# Altium project Node.PrjPCB (part 2 of 3)

## Sheet Power.SchDoc
size Letter
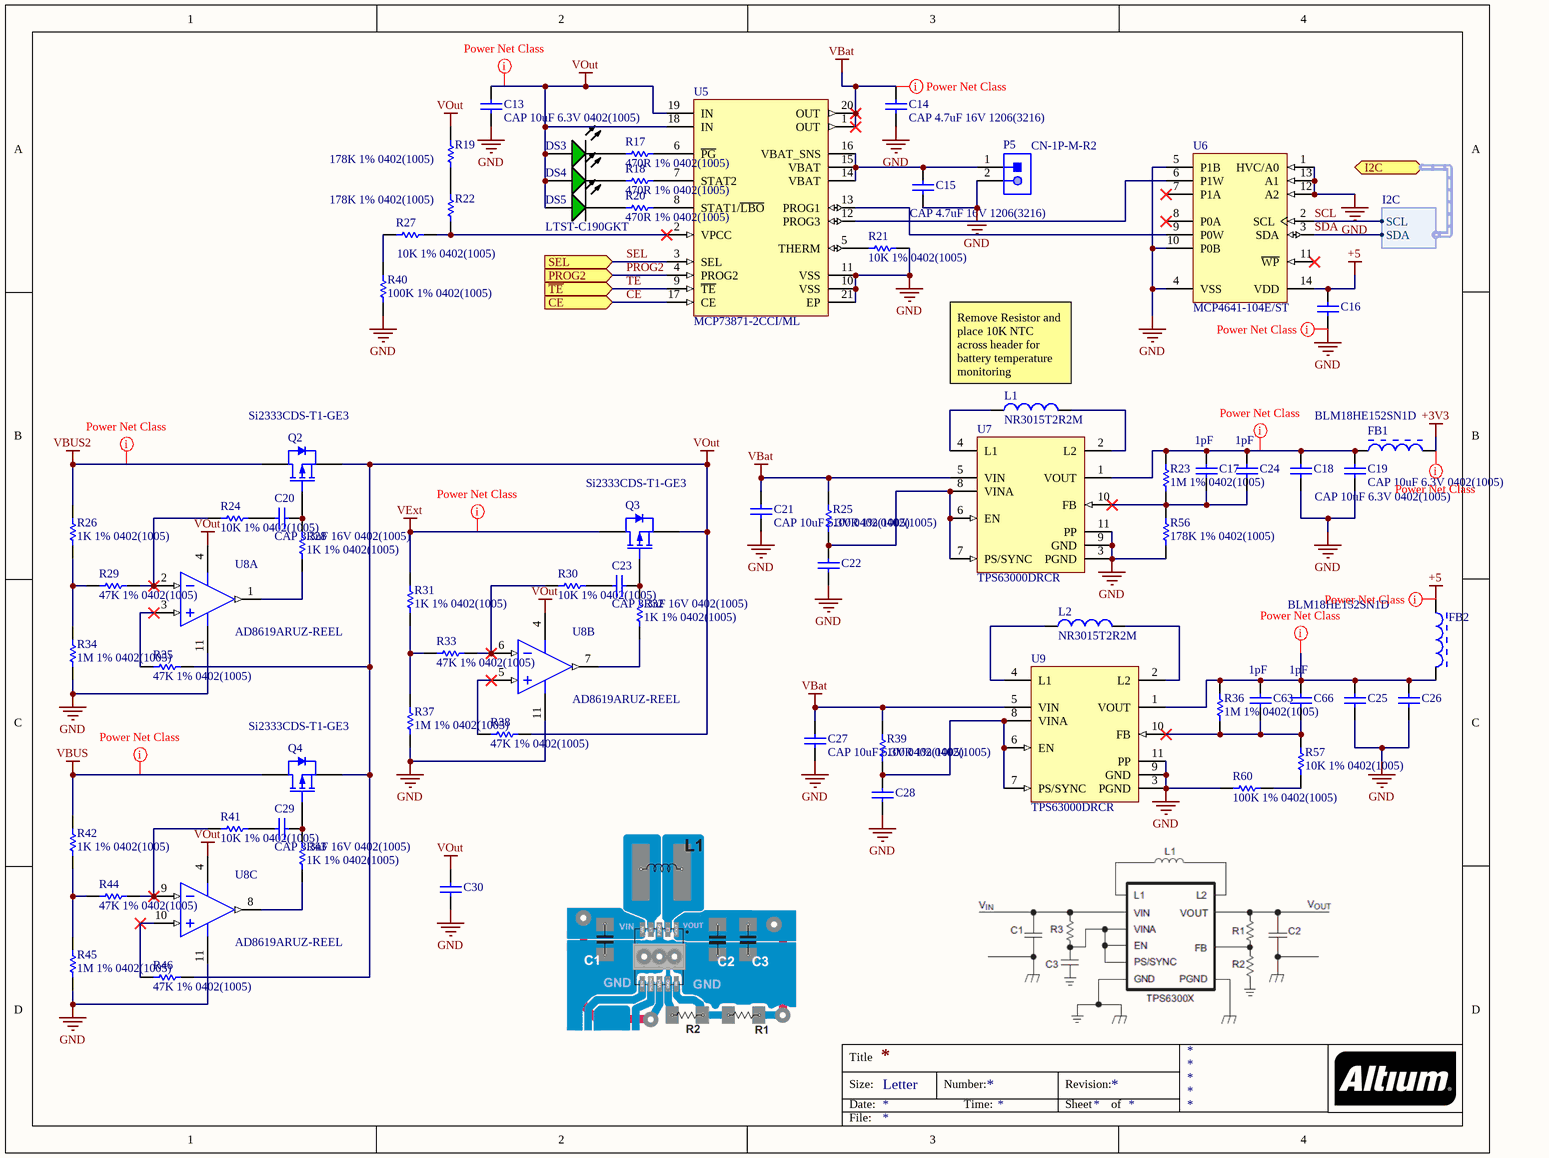
[diagram p6: Power.SchDoc]

### Parts
(Parts that share a designator on the sheet are numbered #1, #2 ... from top to bottom, then left to right.)
C13  CAP 10uF 6.3V 0402(1005)  [CAPC0402(1005)60_L]
C14  CAP 4.7uF 16V 1206(3216)  [CAPC1206(3216)190_N]
C15  CAP 4.7uF 16V 1206(3216)  [CAPC1206(3216)190_N]
C16  CAP 100nF 10V 0402(1005)  [CAPC0402(1005)60_L]  (value not drawn)
C17  value 1pF  [CAPC0402(1005)33_L]  (hidden comment: CAP 1pF 50V 0402(1005))
C18  CAP 10uF 6.3V 0402(1005)  [CAPC0402(1005)60_L]
C19  CAP 10uF 6.3V 0402(1005)  [CAPC0402(1005)60_L]
C20  CAP 3.3nF 16V 0402(1005)  [CAPC0402(1005)60_L]
C21  CAP 10uF 6.3V 0402(1005)  [CAPC0402(1005)60_L]
C22  CAP 100nF 10V 0402(1005)  [CAPC0402(1005)60_L]  (value not drawn)
C23  CAP 3.3nF 16V 0402(1005)  [CAPC0402(1005)60_L]
C24  value 1pF  [CAPC0402(1005)33_L]  (hidden comment: CAP 1pF 50V 0402(1005))
C25  CAP 10uF 6.3V 0402(1005)  [CAPC0402(1005)60_L]  (value not drawn)
C26  CAP 10uF 6.3V 0402(1005)  [CAPC0402(1005)60_L]  (value not drawn)
C27  CAP 10uF 6.3V 0402(1005)  [CAPC0402(1005)60_L]
C28  CAP 100nF 10V 0402(1005)  [CAPC0402(1005)60_L]  (value not drawn)
C29  CAP 3.3nF 16V 0402(1005)  [CAPC0402(1005)60_L]
C30  CAP 100nF 10V 0402(1005)  [CAPC0402(1005)60_L]  (value not drawn)
C63  value 1pF  [CAPC0402(1005)33_L]  (hidden comment: CAP 1pF 50V 0402(1005))
C66  value 1pF  [CAPC0402(1005)33_L]  (hidden comment: CAP 1pF 50V 0402(1005))
DS3  LTST-C190GKT  [LTST-C190GKT_V]  (value not drawn)
DS4  LTST-C190GKT  [LTST-C190GKT_V]  (value not drawn)
DS5  LTST-C190GKT  [LTST-C190GKT_V]
FB1  BLM18HE152SN1D  [MURA-BLM18-RF-H4-CHIP-2_V]
FB2  BLM18HE152SN1D  [MURA-BLM18-RF-H4-CHIP-2_V]
L1  NR3015T2R2M  [TAYO-IND0315_V]
L2  NR3015T2R2M  [TAYO-IND0315_V]
P5  CN-1P-M-R2  [B2B-PH-K-S]
Q2  Si2333CDS-T1-GE3  [DIOD-SOT23-3_V]
Q3  Si2333CDS-T1-GE3  [DIOD-SOT23-3_V]
Q4  Si2333CDS-T1-GE3  [DIOD-SOT23-3_V]
R17  470R 1% 0402(1005)  [RESC0402(1005)_L]
R18  470R 1% 0402(1005)  [RESC0402(1005)_L]
R19  178K 1% 0402(1005)  [RESC0402(1005)_L]
R20  470R 1% 0402(1005)  [RESC0402(1005)_L]
R21  10K 1% 0402(1005)  [RESC0402(1005)_L]
R22  178K 1% 0402(1005)  [RESC0402(1005)_L]
R23  1M 1% 0402(1005)  [RESC0402(1005)_L]
R24  10K 1% 0402(1005)  [RESC0402(1005)_L]
R25  100R 1% 0402(1005)  [RESC0402(1005)_L]
R26  1K 1% 0402(1005)  [RESC0402(1005)_L]
R27  10K 1% 0402(1005)  [RESC0402(1005)_L]
R28  1K 1% 0402(1005)  [RESC0402(1005)_L]
R29  47K 1% 0402(1005)  [RESC0402(1005)_L]
R30  10K 1% 0402(1005)  [RESC0402(1005)_L]
R31  1K 1% 0402(1005)  [RESC0402(1005)_L]
R32  1K 1% 0402(1005)  [RESC0402(1005)_L]
R33  47K 1% 0402(1005)  [RESC0402(1005)_L]
R34  1M 1% 0402(1005)  [RESC0402(1005)_L]
R35  47K 1% 0402(1005)  [RESC0402(1005)_L]
R36  1M 1% 0402(1005)  [RESC0402(1005)_L]
R37  1M 1% 0402(1005)  [RESC0402(1005)_L]
R38  47K 1% 0402(1005)  [RESC0402(1005)_L]
R39  100R 1% 0402(1005)  [RESC0402(1005)_L]
R40  100K 1% 0402(1005)  [RESC0402(1005)_L]
R41  10K 1% 0402(1005)  [RESC0402(1005)_L]
R42  1K 1% 0402(1005)  [RESC0402(1005)_L]
R43  1K 1% 0402(1005)  [RESC0402(1005)_L]
R44  47K 1% 0402(1005)  [RESC0402(1005)_L]
R45  1M 1% 0402(1005)  [RESC0402(1005)_L]
R46  47K 1% 0402(1005)  [RESC0402(1005)_L]
R56  178K 1% 0402(1005)  [RESC0402(1005)_L]
R57  10K 1% 0402(1005)  [RESC0402(1005)_L]
R60  100K 1% 0402(1005)  [RESC0402(1005)_L]
U5  MCP73871-2CCI/ML  [QFN-ML20_M]
U6  MCP4641-104E/ST  [TSSOP-ST14_L]
U7  TPS63000DRCR  [DRC0010J_V]
U8#1  AD8619ARUZ-REEL  [ADI-RU-14_N]  (part A of 4)
U8#2  AD8619ARUZ-REEL  [ADI-RU-14_N]  (parts B,C of 4)
U9  TPS63000DRCR  [DRC0010J_V]

### Ports
CE (in), I2C (harness I2C), PROG2 (in), SEL (in), ~{TE} (in)

### Harnesses
I2C: SCL, SDA

### Nets
+3V3: FB1.2
+5: C16.2 FB2.1 U6.14(VDD)
GND: C13.1 C14.2 C15.1 C16.1 C18.1 C19.1 C21.1 C22.1 C25.1 C26.1 C27.1 C28.1 C30.1 P5.2 R21.2 R34.1 R37.1 R40.2 R45.1 R56.1 R60.1 U5.10(VSS) U5.11(VSS) U5.21(EP) U6.1(HVC/A0) U6.4(VSS) U6.5(P1B) U6.10(P0B) U6.12(A2) U6.13(A1) U7.3(PGND) U7.9(GND) U7.11(PP) U8#1.11(-V) U8#2.11(-V) U9.3(PGND) U9.9(GND) U9.11(PP)
VBat: C14.1 C21.2 C27.2 R25.2 R39.2 U5.1(OUT) U5.20(OUT) U7.5(VIN) U9.5(VIN)
VBUS: Q4.3(D) R42.2
VBUS2: Q2.3(D) R26.2
VExt: Q3.3(D) R31.2
VOut: C13.2 C30.2 DS3.1(A) DS4.1(A) DS5.1(A) Q2.2(S) Q3.2(S) Q4.2(S) R19.1 R35.2 R38.2 R46.2 U5.18(IN) U5.19(IN) U8#1.4(+V) U8#2.4(+V)
CE: U5.17(CE) ; port CE
PROG2: U5.4(PROG2) ; port PROG2
SCL: U6.2(SCL) ; port I2C.SCL
SDA: U6.3(SDA) ; port I2C.SDA
SEL: U5.3(SEL) ; port SEL
~{TE}: U5.9(~{TE}) ; port ~{TE}
NetC15_2: C15.2 P5.1 U5.14(VBAT) U5.15(VBAT) U5.16(VBAT_SNS)
NetC17_1: C17.1 C24.1 R23.1 R56.2 U7.10(FB)
NetC17_2: C17.2 C18.2 C19.2 C24.2 FB1.1 R23.2 U7.1(VOUT)
NetC20_1: C20.1 Q2.1(G) R28.2
NetC20_2: C20.2 R24.2
NetC22_2: C22.2 R25.1 U7.6(EN) U7.7(PS/SYNC) U7.8(VINA)
NetC23_1: C23.1 Q3.1(G) R32.2
NetC23_2: C23.2 R30.2
NetC25_2: C25.2 C26.2 C63.2 C66.2 FB2.2 R36.2 U9.1(VOUT)
NetC28_2: C28.2 R39.1 U9.6(EN) U9.7(PS/SYNC) U9.8(VINA)
NetC29_1: C29.1 Q4.1(G) R43.2
NetC29_2: C29.2 R41.2
NetC63_1: C63.1 C66.1 R36.1 R57.2 U9.10(FB)
NetDS3_2: DS3.2(K) R17.1
NetDS4_2: DS4.2(K) R18.1
NetDS5_2: DS5.2(K) R20.1
NetL1_1: L1.1 U7.4(L1)
NetL1_2: L1.2 U7.2(L2)
NetL2_1: L2.1 U9.4(L1)
NetL2_2: L2.2 U9.2(L2)
NetR17_2: R17.2 U5.6(~{PG})
NetR18_2: R18.2 U5.7(STAT2)
NetR19_2: R19.2 R22.1
NetR20_2: R20.2 U5.8(STAT1/~{LBO})
NetR21_1: R21.1 U5.5(THERM)
NetR22_2: R22.2 R27.2 U5.2(VPCC)
NetR24_1: R24.1 R29.2 U8#1.2(-IN_A)
NetR26_1: R26.1 R29.1 R34.2
NetR27_1: R27.1 R40.1
NetR28_1: R28.1 U8#1.1(OUT_A)
NetR30_1: R30.1 R33.2 U8#2.6(-IN_B)
NetR31_1: R31.1 R33.1 R37.2
NetR32_1: R32.1 U8#2.7(OUT_B)
NetR35_1: R35.1 U8#1.3(+IN_A)
NetR38_1: R38.1 U8#2.5(+IN_B)
NetR41_1: R41.1 R44.2 U8#2.9(-IN_C)
NetR42_1: R42.1 R44.1 R45.2
NetR43_1: R43.1 U8#2.8(OUT_C)
NetR46_1: R46.1 U8#2.10(+IN_C)
NetR57_1: R57.1 R60.2
NetU5_12: U5.12(PROG3) U6.6(P1W)
NetU5_13: U5.13(PROG1) U6.9(P0W)

Not connected (* = marked no-connect by the designer): U6 7(P1A)* 8(P0A)* 11(~{WP})*

### Layout directives
net class PowerNets: +3V3, +5, GND, NetC17_2, NetC25_2, VBat, VBUS, VBUS2, VExt, VOut

### Notes on the sheet
- (near L1) Remove Resistor and place 10K NTC across header for battery temperature monitoring
- Title
- Size:
- Date:
- Letter
- Number:
- Time:
- Revision:
- Sheet
- of
- File:

### Library data of the parts
C13 = CMP-1034-02138-1: CAP 10uF 6.3V ±20% 0402 (1005 Metric) Thickness 0.6mm SMD; Case-Metric: 1005; Tolerance: Â±20%; Case-EIA: 0402; Rated Voltage: 6.3 V; Value: 10uF; Technology: SMT; Max Thickness: 0.6 mm
C14 C15 = CMP-1037-04912-1: CAP 4.7uF 16V ±20% 1206 (3216 Metric) Thickness 1.9mm SMD; Tolerance: Â±20%; Case-EIA: 1206; Case-Metric: 3216; Max Thickness: 1.9 mm; Technology: SMT; Rated Voltage: 16 V; Value: 4.7uF
C16 C22 C28 C30 = CMP-1034-02066-1: as C1 on sheet Interface; Max Thickness: 0.6 mm; Rated Voltage: 10 V; Technology: SMT; Value: 100nF
C17 C24 C63 C66 = CMP-1034-00058-1: CAP 1pF 50V ±0.25pF 0402 (1005 Metric) Thickness 0.33mm SMD; Case-Metric: 1005; Case-EIA: 0402; Tolerance: Â±0.25pF; Technology: SMT; Max Thickness: 0.33 mm; Rated Voltage: 50 V
C18 C19 C21 C25-C27 = CMP-1034-02138-1: CAP 10uF 6.3V ±20% 0402 (1005 Metric) Thickness 0.6mm SMD; Tolerance: Â±20%; Case-EIA: 0402; Case-Metric: 1005; Max Thickness: 0.6 mm; Rated Voltage: 6.3 V; Technology: SMT; Value: 10uF
C20 C23 C29 = CMP-1034-01771-1: CAP 3.3nF 16V ±5% 0402 (1005 Metric) Thickness 0.6mm SMD; Case-EIA: 0402; Case-Metric: 1005; Tolerance: Â±5%; Value: 3.3nF; Technology: SMT; Rated Voltage: 16 V; Max Thickness: 0.6 mm
DS3-DS5 = CMP-1674-00007-1: LED Uni-Color Green, 100 mW, 5 V, -55 to 85 degC, 2-Pin SMD, RoHS, Tape and Reel; ComponentLink2Description: Datasheet; ComponentLink2URL: http://datasheet.octopart.com/LTST-C190GKT-Lite-On-datasheet-158530.pdf; ComponentLink1Description: Manufacturer URL; PackageReference: C190GKT; PackageDescription: 2-Pin Surface Mount Device, Body 1.6 x 0.8 mm; ComponentLink1URL: http://www.us.liteon.com/; DatasheetVersion: Dec-06
FB1 FB2 = CMP-0686-00368-2: Chip Ferrite Bead for GHz Band High-speed Signal Lines, 1500 Ohm, 500 mA, -55 to 125 degC, 1.6 x 0.8 x 0.95 mm SMD, Tape and Reel; Manufacturer: Murata; Rated Current: 500 mA; Impedance (at 100 MHz): 1500 Ohm +/- 25%; DC Resistance: 0.50 Ohm Max.; Packing: Tape and Reel; DatasheetVersion: 08/2013; ComponentLink1URL: http://www.murata.com/; Mounting Technology: Surface Mount; ComponentLink2URL: http://www.murata.com/products/catalog/pdf/c31e.pdf; ComponentLink3Description: Package Specification; ComponentLink2Description: Datasheet; PackageReference: BLM18_H950-2; ComponentLink1Description: Manufacturer URL; PackageDescription: 2-Pin Chip, Body 1.6 x 0.8 mm; ComponentLink3URL: http://www.murata.com/products/catalog/pdf/c31e.pdf; PartNumber: BLM18HE152SN1D; Operating Temperature Range: -55 to 125 degC
L1 L2 = CMP-0569-00001-2: SMD Power Inductor, 2.2 uH, +/- 20%, 3 x 3 x 1.5 mm, -25 to 120 degC, Pb-Free, Tape and Reel; Manufacturer: Taiyo Yuden; Inductance: 2.2 uH (+/-20%); Rated Current-Temperature Rise Current: 1500 mA; DC Resistance (max): 0.072 Ohm; Rated Current-Saturation Current: 1480 mA; Inductance Measuring Frequency: 100 kHz; Self-Resonant Frequency (min): 64 MHz; Avg. of DC. Resistance: 0.06 Ohm; Soldering Method: Reflow; Temperature Range: -25 to 120 degC; ComponentLink1Description: Manufacturer URL; Mounting Technology: Surface Mount; Halogen Free: TRUE; ComponentLink1URL: www.yuden.co.jp; Packing: Tape and Reel; DatasheetVersion: 1/11/2013; PackageDescription: 2-Pin SMT Inductor, Body 3 x 3 mm; ComponentLink2URL: http://www.yuden.co.jp/ut/product/category/inductor/NR3015T2R2M.pdf; PartNumber: NR3015T2R2M; RoHS Compliance: TRUE; PackageReference: IND3015; ComponentLink2Description: Datasheet; Case Size: 3015
Q2-Q4 = CMP-00020-0000-A.2: MOSFET 12V 5.1A 2.5W 35 mohms @ 4.5V; Manufacturer: Vishay; Channel Mode: Enhancement; Brand: Vishay Semiconductors; Rise Time: 35 ns; Transistor Polarity: P-Channel; Vgs - Gate-Source Voltage: 8 V; Number of Channels: 1 Channel; Pd - Power Dissipation: 1.25 W; Configuration: Single; Typical Turn-Off Delay Time: 45 ns; Transistor Type: 1 P-Channel; Vds - Drain-Source Breakdown Voltage: - 12 V; Typical Turn-On Delay Time: 13 ns; Tradename: TrenchFET; Standard Pack Qty: 3000; Reeling: True; Supplier Part Number: 781-SI2333CDS-T1-GE3; Series: SI2; Length: 3.04 mm; ComponentLink1URL: http://www.mouser.com/ds/2/427/si2333cd-244460.pdf; RoHS - Mouser: Y; Technology: Si; Width: 1.4 mm; Maximum Operating Temperature: + 150 C; Rds On - Drain-Source Resistance: 35 mOhms; Product: MOSFET Small Signal; Manufacturer Part Number: Si2333CDS-T1-GE3; Minimum Operating Temperature: - 55 C; Minimum Order Quantity: 1; Height: 1.02 mm; Supplier: Mouser; ComponentLink1Description: si2333cd-244460.pdf; Id - Continuous Drain Current: 5.1 A; Fall Time: 35 ns; Mounting Style: SMD/SMT; Package / Case: SOT-23-3; Packaging: Reel
R17 R18 R20 = CMP-1011-00473-1: 470R 0.063W 1% 0402 (1005 Metric)  SMD; Case-Metric: 1005; Case-EIA: 0402; Value: 470.00 Ohm; Tolerance: 1 %; Technology: SMT; Power: 0.063 W
R19 R22 R56 = CMP-1011-00762-1: 178K 0.063W 1% 0402 (1005 Metric)  SMD; Case-Metric: 1005; Case-EIA: 0402; Value: 178000.00 Ohm; Technology: SMT; Power: 0.063 W; Tolerance: 1 %
R21 = CMP-1011-00623-1: as R10 on sheet Interface; Technology: SMT; Tolerance: 1 %; Power: 0.063 W
R23 R34 R36 R37 R45 = CMP-1011-00849-1: 1M 0.063W 1% 0402 (1005 Metric)  SMD; Value: 1000000.00 Ohm; Case-EIA: 0402; Case-Metric: 1005; Power: 0.063 W; Tolerance: 1 %; Technology: SMT
R24 R27 R30 R41 R57 = CMP-1011-00623-1: 10K 0.063W 1% 0402 (1005 Metric)  SMD; Value: 10000.00 Ohm; Case-EIA: 0402; Case-Metric: 1005; Power: 0.063 W; Tolerance: 1 %; Technology: SMT
R25 R39 = CMP-1011-00397-1: 100R 0.063W 1% 0402 (1005 Metric)  SMD; Case-EIA: 0402; Value: 100.00 Ohm; Case-Metric: 1005; Tolerance: 1 %; Technology: SMT; Power: 0.063 W
R26 R28 R31 R32 R42 R43 = CMP-1011-00510-1: 1K 0.063W 1% 0402 (1005 Metric)  SMD; Case-Metric: 1005; Case-EIA: 0402; Value: 1000.00 Ohm; Technology: SMT; Tolerance: 1 %; Power: 0.063 W
R29 R33 R35 R38 R44 R46 = CMP-1011-00699-1: 47K 0.063W 1% 0402 (1005 Metric)  SMD; Case-Metric: 1005; Case-EIA: 0402; Value: 47000.00 Ohm; Technology: SMT; Power: 0.063 W; Tolerance: 1 %
R40 R60 = CMP-1011-00736-1: as R1 on sheet Interface; Power: 0.063 W; Tolerance: 1 %; Technology: SMT
U5 = CMP-0133-00005-1: Stand-Alone System Load Sharing and Li-Ion/Li-Polymer Battery Charge Management Controller, 4.2V, 20-Pin QFN, Industrial Temperature; PackageDescription: 20-Lead Plastic Quad Flat, No Lead Package (ML) - 4x4x0.9 mm Body [QFN]; PackageReference: QFN-ML20; PackageVersion: revBB, Aug-2009; DatasheetVersion: revB, May-2009
U6 = CMP-0188-00813-2: 7-Bit Dual I2C Digital POT with Non-Volatile Memory, 14-pin TSSOP, Extended Temperature; ComponentLink1URL: http://www.microchip.com/; ComponentLink3Description: Package Specification; PackageDescription: 14-Lead Plastic Thin Shrink Small Outline (ST) - 4.4mm Body [TSSOP]; ComponentLink2URL: http://ww1.microchip.com/downloads/en/DeviceDoc/22107a.pdf; DatasheetVersion: revA, Nov-2008; ComponentLink2Description: Datasheet; ComponentLink3URL: http://www.microchip.com/stellent/groups/techpub_sg/documents/packagingspec/en012702.pdf; ComponentLink1Description: Manufacturer URL; RevisionNote: URLs added.; PackageVersion: revBB, Aug-2009; PackageReference: TSSOP-ST14
U7 U9 = CMP-0345-00001-2: Buck-Boost Voltage Converter with 1.8 to 5.5 V Input and 1.2 to 5.5 V Output, -40 to 85 degC, 10-Pin SON (DRC), Green (RoHS & no Sb/Br); Manufacturer: Texas Instruments; Vout(Max)(V): 5.5; Synchronous Rectification: TRUE; SubFamily: Buck-Boost Regulator; Vin(Min)(V): 1.8; Iq(Typ)(mA): 0.04; Iout(Max)(A): 1.2; Regulated Outputs(#): 1; Switching Frequency(Max)(kHz): 1500; ComponentLink1Description: Datasheet; Mounting Technology: Surface Mount; DatasheetVersion: SLVS520B; Eco-Plan: Green (RoHS & no Sb/Br); PackageVersion: revL, Sep-2011; PackageDescription: 10-Pin Plastic Small Outline No-Lead, 3 x 3 x 1 mm Body, 0.5 mm Pitch, Exposed Pad; Vout(Min)(V): 1.2; Vin(Max)(V): 5.5; Topology: Buck-Boost; Dynamic Voltage Scaling: TRUE; ComponentLink1URL: http://www.ti.com/general/docs/lit/getliterature.tsp?genericPartNumber=TPS63000&fileType=pdf; PartNumber: TPS63000DRCR; ComponentLink2URL: http://www.ti.com/litv/pdf/mpds117k; PackageReference: DRC0010J; ComponentLink2Description: Package Specification
U8#1 U8#2 = CMP-0384-01896-1: Quad Channel Single-Supply Operation Operational Amplifier, 400 KHz BW, 100 mV/us SR, Industrial, 14-pin SOP (RU-14), Reel; Generic Part Number: AD8619; Manufacturer: Analog Devices; Iq/Amp: 38uA; V Span Max: 5V; V Span Min: 1.8V; Input Bias Current: 200fA; Amplifiers Per Package: 4; Input Offset Voltage: 400uV; Small Signal Bandwidth: 400KHz; ComponentLink2Description: Datasheet; Mounting Technology: Surface Mount; PackageDescription: 14-Pin Thin Shrink Small Outline Package, Body 5 x 4.4 mm, Pitch 0.65 mm; DatasheetVersion: Rev. E; Code_JEDEC: MO-153AB-1; ComponentLink2URL: http://www.analog.com/static/imported-files/data_sheets/AD8613_8617_8619.pdf; ComponentLink3URL: http://www.analog.com/static/imported-files/packages/36057385283879153717235186773RU14.pdf; ComponentLink1Description: Manufacturer URL; ComponentLink3Description: Package Specification; Slew Rate: 100mV/us; ComponentLink1URL: http://www.analog.com/en/index.html; PartNumber: AD8619ARUZ-REEL; PackageReference: RU-14; PartId: 1

## Sheet RF.SchDoc
size Letter
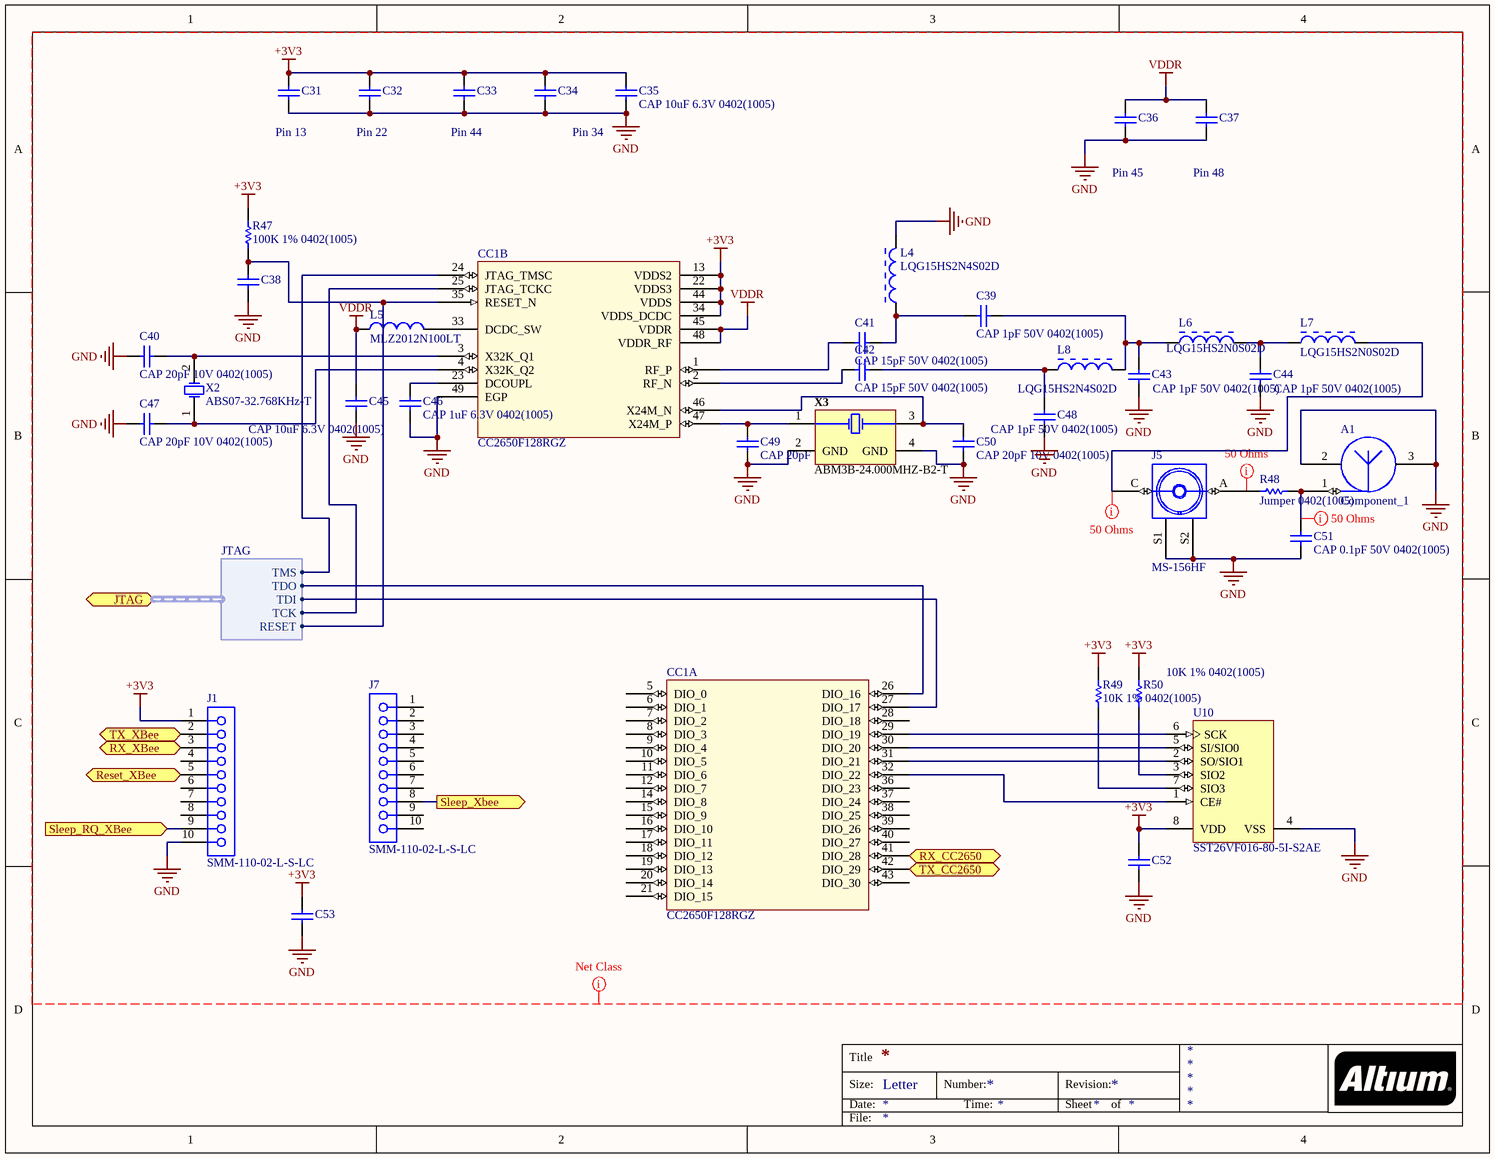
[diagram p7: RF.SchDoc]

### Parts
A1  Component_1  [Microstrip Antenna]  (net tie, no BOM)
C31  CAP 100nF 10V 0402(1005)  [CAPC0402(1005)60_L]  (value not drawn)
C32  CAP 100nF 10V 0402(1005)  [CAPC0402(1005)60_L]  (value not drawn)
C33  CAP 100nF 10V 0402(1005)  [CAPC0402(1005)60_L]  (value not drawn)
C34  CAP 100nF 10V 0402(1005)  [CAPC0402(1005)60_L]  (value not drawn)
C35  CAP 10uF 6.3V 0402(1005)  [CAPC0402(1005)60_L]
C36  CAP 100nF 10V 0402(1005)  [CAPC0402(1005)60_L]  (value not drawn)
C37  CAP 100nF 10V 0402(1005)  [CAPC0402(1005)60_L]  (value not drawn)
C38  CAP 100nF 10V 0402(1005)  [CAPC0402(1005)60_L]  (value not drawn)
C39  CAP 1pF 50V 0402(1005)  [CAPC0402(1005)33_L]
C40  CAP 20pF 10V 0402(1005)  [CAPC0402(1005)60_L]
C41  CAP 15pF 50V 0402(1005)  [CAPC0402(1005)33_L]
C42  CAP 15pF 50V 0402(1005)  [CAPC0402(1005)33_L]
C43  CAP 1pF 50V 0402(1005)  [CAPC0402(1005)33_L]
C44  CAP 1pF 50V 0402(1005)  [CAPC0402(1005)33_L]
C45  CAP 10uF 6.3V 0402(1005)  [CAPC0402(1005)60_L]
C46  CAP 1uF 6.3V 0402(1005)  [CAPC0402(1005)60_L]
C47  CAP 20pF 10V 0402(1005)  [CAPC0402(1005)60_L]
C48  CAP 1pF 50V 0402(1005)  [CAPC0402(1005)33_L]
C49  CAP 20pF 10V 0402(1005)  [CAPC0402(1005)60_L]
C50  CAP 20pF 10V 0402(1005)  [CAPC0402(1005)60_L]
C51  CAP 0.1pF 50V 0402(1005)  [CAPC0402(1005)33_L]
C52  CAP 100nF 10V 0402(1005)  [CAPC0402(1005)60_L]  (value not drawn)
C53  CAP 100nF 10V 0402(1005)  [CAPC0402(1005)60_L]  (value not drawn)
CC1  CC2650F128RGZ  [RGZ48-4100X4100TP]  (parts A,B of 2)
J1  SMM-110-02-L-S-LC  [SMTC-SMM-110-02-X-S-LC]
J5  MS-156HF  [MS-156HF]
J7  SMM-110-02-L-S-LC  [SMTC-SMM-110-02-X-S-LC]
L4  LQG15HS2N4S02D  [MURA-IND0402_V]
L5  MLZ2012N100LT  [TDK-IND0805-125_V]
L6  LQG15HS2N0S02D  [MURA-IND0402_V]
L7  LQG15HS2N0S02D  [MURA-IND0402_V]
L8  LQG15HS2N4S02D  [MURA-IND0402_V]
R47  100K 1% 0402(1005)  [RESC0402(1005)_L]
R48  Jumper 0402(1005)  [RESC0402(1005)_L]
R49  10K 1% 0402(1005)  [RESC0402(1005)_L]
R50  10K 1% 0402(1005)  [RESC0402(1005)_L]
U10  SST26VF016-80-5I-S2AE  [MCHP-SOIC-S2A8_L]
X2  ABS07-32.768KHz-T  [ABRA-ABS07-2_V]
X3  ABM3B-24.000MHZ-B2-T  [ABRA-ABM3B-4_V]

### Ports
JTAG (harness JTAG), Reset_XBee (in), RX_CC2650 (in), RX_XBee (in), Sleep_RQ_XBee (in), Sleep_Xbee (out), TX_CC2650 (out), TX_XBee (out)

### Harnesses
JTAG: RESET, TCK, TDI, TDO, TMS

### Nets
+3V3: C31.2 C32.2 C33.2 C34.2 C35.2 C52.2 C53.2 CC1.13(VDDS2) CC1.22(VDDS3) CC1.34(VDDS_DCDC) CC1.44(VDDS) J1.1 R47.2 R49.2 R50.2 U10.8(VDD)
GND: A1.2 A1.3 C31.1 C32.1 C33.1 C34.1 C35.1 C36.1 C37.1 C38.1 C40.1 C43.1 C44.1 C45.1 C46.1 C47.1 C48.1 C49.2 C50.2 C51.1 C52.1 C53.1 CC1.49(EGP) J1.10 J5.S1 J5.S2 L4.2 U10.4(VSS) X3.2(GND) X3.4(GND)
VDDR: C36.2 C37.2 C45.2 CC1.45(VDDR) CC1.48(VDDR_RF) L5.1
NetA1_1: A1.1 C51.2 R48.2
NetC38_2: C38.2 CC1.35(RESET_N) R47.1 ; port JTAG.RESET
NetC39_1: C39.1 C41.2 L4.1
NetC39_2: C39.2 C43.2 L6.1 L8.2
NetC40_2: C40.2 CC1.3(X32K_Q1) X2.2(X2)
NetC41_1: C41.1 CC1.1(RF_P)
NetC42_1: C42.1 CC1.2(RF_N)
NetC42_2: C42.2 C48.2 L8.1
NetC44_2: C44.2 L6.2 L7.1
NetC46_2: C46.2 CC1.23(DCOUPL)
NetC47_2: C47.2 CC1.4(X32K_Q2) X2.1(X1)
NetC49_1: C49.1 CC1.47(X24M_P) X3.1(X1)
NetC50_1: C50.1 CC1.46(X24M_N) X3.3(X2)
NetCC1_24: CC1.24(JTAG_TMSC) ; port JTAG.TMS
NetCC1_25: CC1.25(JTAG_TCKC) ; port JTAG.TCK
NetCC1_26: CC1.26(DIO_16) ; port JTAG.TDO
NetCC1_27: CC1.27(DIO_17) ; port JTAG.TDI
NetCC1_29: CC1.29(DIO_19) U10.6(SCK)
NetCC1_30: CC1.30(DIO_20) U10.5(SI/SIO0)
NetCC1_31: CC1.31(DIO_21) U10.2(SO/SIO1)
NetCC1_32: CC1.32(DIO_22) U10.1(CE#)
NetCC1_33: CC1.33(DCDC_SW) L5.2
NetCC1_41: CC1.41(DIO_28) ; port RX_CC2650
NetCC1_42: CC1.42(DIO_29) ; port TX_CC2650
NetJ1_2: J1.2 ; port TX_XBee
NetJ1_3: J1.3 ; port RX_XBee
NetJ1_5: J1.5 ; port Reset_XBee
NetJ1_9: J1.9 ; port Sleep_RQ_XBee
NetJ5_A: J5.A R48.1
NetJ5_C: J5.C L7.2
NetJ7_8: J7.8 ; port Sleep_Xbee
NetR49_1: R49.1 U10.7(SIO3)
NetR50_1: R50.1 U10.3(SIO2)

Not connected (* = marked no-connect by the designer): CC1 5(DIO_0) 6(DIO_1) 7(DIO_2) 8(DIO_3) 9(DIO_4) 10(DIO_5) 11(DIO_6) 12(DIO_7) 14(DIO_8) 15(DIO_9) 16(DIO_10) 17(DIO_11) 18(DIO_12) 19(DIO_13) 20(DIO_14) 21(DIO_15) 28(DIO_18) 36(DIO_23) 37(DIO_24) 38(DIO_25) 39(DIO_26) 40(DIO_27) 43(DIO_30); J1 4 6 7 8; J7 1 2 3 4 5 6 7 9 10

### Layout directives
net class 50_Ohms: NetA1_1, NetJ5_A, NetJ5_C
net class RF: +3V3, GND, VDDR

### Notes on the sheet
- (near C31) Pin 13
- (near C32) Pin 22
- (near C33) Pin 44
- Pin 34
- (near C36) Pin 45
- (near C37) Pin 48
- Title
- Size:
- Date:
- Letter
- Number:
- Time:
- Revision:
- Sheet
- of
- File:

### Library data of the parts
C31-C34 C36-C38 C52 C53 = CMP-1034-02066-1: as C1 on sheet Interface; Max Thickness: 0.6 mm; Rated Voltage: 10 V; Technology: SMT; Value: 100nF
C35 C45 = CMP-1034-02138-1: as C18 on sheet Power; Max Thickness: 0.6 mm; Rated Voltage: 6.3 V; Technology: SMT; Value: 10uF
C39 C43 C44 C48 = CMP-1034-00058-1: as C17 on sheet Power; Technology: SMT; Max Thickness: 0.33 mm; Value: 1pF; Rated Voltage: 50 V
C40 C47 C49 C50 = CMP-1034-00874-1: as C101 on sheet NFC; Value: 20pF; Rated Voltage: 10 V; Technology: SMT; Max Thickness: 0.6 mm
C41 C42 = CMP-1034-00814-1: CAP 15pF 50V ±5% 0402 (1005 Metric) Thickness 0.33mm SMD; Tolerance: Â±5%; Case-Metric: 1005; Case-EIA: 0402; Max Thickness: 0.33 mm; Value: 15pF; Rated Voltage: 50 V; Technology: SMT
C46 = CMP-1034-02115-1: as C3 on sheet Interface; Value: 1uF; Tolerance: -20% to +80%; Rated Voltage: 6.3 V; Max Thickness: 0.6 mm; Technology: SMT
C51 = CMP-1034-00002-1: CAP 0.1pF 50V ±0.1pF 0402 (1005 Metric) Thickness 0.33mm SMD; Case-EIA: 0402; Tolerance: Â±0.1pF; Case-Metric: 1005; Max Thickness: 0.33 mm; Technology: SMT; Value: 0.1pF; Rated Voltage: 50 V
CC1 = CMP-00021-0000-A.2: RF Microcontrollers - MCU SimpleLink multi-std Wireless MCU 2.4Ghz; Manufacturer Part Number: CC2650F128RGZT; Output Power: 5 dBm; Program Memory Type: Flash; Brand: Texas Instruments; Data RAM Size: 20 kB; Data RAM Type: SRAM; Interface Type: I2C, I2S, SSI, UART; Number of I/Os: 31 I/O; Program Memory Size: 128 kB; ADC Resolution: 12 bit; Core: ARM Cortex M3; Data Bus Width: 32 bit; Maximum Clock Frequency: 48 MHz; Number of ADC Channels: 8; Number of Timers: 4 Timer; Operating Supply Voltage: 1.7 V to 3.8 V; Processor Series: CC26xx; Product Status: New Product; Operating Frequency: 2.4 GHz; Package / Case: VQFN-48; Packaging: Reel; Series: CC2650; Mounting Style: SMD/SMT; Manufacturer: Texas Instruments; Standard Pack Qty: 250; Tradename: SimpleLink; RoHS - Mouser: Y; Minimum Order Quantity: 1; Reeling: True; Supplier: Mouser; Supplier Part Number: 595-CC2650F128RGZT
J1 J7 = CMP-1022-00175-1: Tiger Eye(TM) Socket Strip, Surface Mount, Vertical, -55 to 125 degC, 2 mm Pitch, 10-Pin, Female, RoHS; Manufacturer: Samtec; Pitch: 2 mm; ComponentLink1Description: Manufacturer URL; PackageVersion: BC, 5/1991; PackageDescription: 2 mm Socket Strip (Single Row); ComponentLink2Description: Datasheet; ComponentLink3URL: http://www.samtec.com/documents/webfiles/cpdf/SMM-1XX-XX-XX-S-XX-X-XX-XX-MKT.pdf; ComponentLink2URL: http://www.samtec.com/documents/webfiles/pdf/SMM.PDF; PackageReference: SMM-110-02-X-S-LC; Temperature Range: -55 to 125 degC; Orientation: Vertical; PartNumber: SMM-110-02-L-S-LC; RoHS: True; Mounting Technology: Surface Mount; DatasheetVersion: F-214; ComponentLink3Description: Package Specification; ComponentLink1URL: http://www.samtec.com
J5 = MS-156HF: Subminiature Coaxial Swtich, 1.6mm High, DC - 6GHz
L4 L8 = CMP-0499-00001-3: Chip Inductor (Chip Coil) for High Frequency Multilayer, 2.4 +/- 0.3 nH, 300 mA, 0402 (1005), 180mm Paper Tape; Manufacturer: Murata; Self Resonance Frequency (min.): 6000 MHz; Inductance Test Frequency: 100 MHz; Inductance: 2.4 nH +/- 0.3 nH; Rated Current (Itemp) (Based on Temperature rise): 300 mA; Max. Of DC Resistance: 0.1 ohm; Q (min.): 8; Operating Temperature Range: -55 to 125 degC; Mounting Technology: Surface Mount; PackageDescription: 2-Pin SMT Inductor, 1 x 0.5 mm Body; ComponentLink2URL: http://search.murata.co.jp/Ceramy/image/img/PDF/ENG/L0075S0083LQG15HS.pdf; ComponentLink1Description: Manufacturer URL; ComponentLink3URL: http://search.murata.co.jp/Ceramy/image/img/PDF/ENG/L0075S0083LQG15HS.pdf; ComponentLink1URL: http://www.murata.com/; ComponentLink2Description: Datasheet; RoHS: Yes; ComponentLink3Description: Package Specification; Q Test Frequency: 100 MHz; PackageReference: IND0402; PartNumber: LQG15HS2N4S02D
L5 = CMP-0266-00001-1: Multilayer Inductor, 10 uH, ±20%, 300 mOhm, 50MHz, 0805(2012); DC Resistance: 0.3 Ohm; PackageReference: IND0805-125; ComponentLink1URL: http://www.global.tdk.com/; DatasheetVersion: 05/2013; ComponentLink2Description: Datasheet; ComponentLink1Description: Manufacturer URL; Mounting Technology: Suface Mount; ComponentLink2URL: http://www.tdk.co.jp/tcfx01/c533_mlz.pdf; PartNumber: MLZ2012N100LT; PackageDescription: 2-Pin SMT Inductor, 2 x 1.25 mm Body
L6 L7 = CMP-0499-00001-3: Chip Inductor (Chip Coil) for High Frequency Multilayer, 2 +/- 0.3 nH, 300 mA, 0402 (1005), 180mm Paper Tape; Manufacturer: Murata; Self Resonance Frequency (min.): 6000 MHz; Inductance Test Frequency: 100 MHz; Inductance: 2.0 nH +/- 0.3 nH; Rated Current (Itemp) (Based on Temperature rise): 300 mA; Max. Of DC Resistance: 0.1 ohm; Q (min.): 8; Operating Temperature Range: -55 to 125 degC; Mounting Technology: Surface Mount; PackageDescription: 2-Pin SMT Inductor, 1 x 0.5 mm Body; ComponentLink2URL: http://search.murata.co.jp/Ceramy/image/img/PDF/ENG/L0075S0083LQG15HS.pdf; ComponentLink1Description: Manufacturer URL; ComponentLink3URL: http://search.murata.co.jp/Ceramy/image/img/PDF/ENG/L0075S0083LQG15HS.pdf; ComponentLink1URL: http://www.murata.com/; ComponentLink2Description: Datasheet; RoHS: Yes; ComponentLink3Description: Package Specification; Q Test Frequency: 100 MHz; PackageReference: IND0402; PartNumber: LQG15HS2N0S02D
R47 = CMP-1011-00736-1: as R1 on sheet Interface; Power: 0.063 W; Tolerance: 1 %; Technology: SMT
R48 = CMP-1011-00001-1: Jumper 0402 (1005 Metric); Tolerance: None; Case-Metric: 1005; Case-EIA: 0402; Value: 0.00 Ohm; Power: None; Technology: SMT
R49 R50 = CMP-1011-00623-1: as R10 on sheet Interface; Technology: SMT; Tolerance: 1 %; Power: 0.063 W
U10 = CMP-0378-00053-1: 16 Mbit Serial Quad I/O (SQI) Flash Memory, 2.7 to 3.6 V, 80 MHz, -40 to 85 degC, 8-pin SOIC (S2A8), Tube; Manufacturer: Microchip; ComponentLink2URL: http://ww1.microchip.com/downloads/en/DeviceDoc/25017A.pdf; PackageVersion: Rev. A; PackageDescription: 8-Lead Plastic Small Outline Intergrated Circuit, 5.275 x 5.275 mm Body, 1.27 mm Pitch; ComponentLink3Description: Package Specification; PartNumber: SST26VF016-80-5I-S2AE; ComponentLink1Description: Manufacturer URL; PackageReference: SOIC-S2A8; Mounting Technology: Surface Mount; ComponentLink3URL: http://ww1.microchip.com/downloads/en/DeviceDoc/25051A.pdf; DatasheetVersion: Rev. A; ComponentLink2Description: Datasheet; ComponentLink4URL: http://www.microchip.com/SST26VF016; ComponentLink1URL: http://www.microchip.com; ComponentLink4Description: Product URL
X2 = CMP-0447-00001-2: Crystal, 32.768 kHz, 12.5 pF, -40 to 85 degC, SMD Low Profile 3.2 x 1.5 x 0.9 mm, Tape and Reel; Manufacturer: Abracon; Q Value (Type): 30000; Operation Mode: Flexural Mode (Tuning Fork); Shunt Capacitance (C0): 0.9 to 1.2 pF; Load Capacitance (CL): 12.5 pF; Frequency Tolerance @+25degC: +/- 20 ppm; Drive Level (Type): 0.1 uW; Equivalent Series Resistance (R1): 70 Kohm; Insulation Resistance (Min): 500 Mohm; ComponentLink3URL: http://www.abracon.com/Resonators/ABS07.pdf; PackageDescription: 2-Pin Hand Drawn, Body 3.2x1.5mm, Pitch 2.5mm; Operating Temperature: -40 to 85 degC; ComponentLink2URL: http://www.abracon.com/Resonators/ABS07.pdf; PackageReference: ABS07-2; ComponentLink3Description: Package Specification; ComponentLink1Description: Manufacturer URL; DatasheetVersion: 04.03.13; Mounting Technology: Surface Mount; ComponentLink2Description: Datasheet; ComponentLink1URL: http://www.abracon.com/; PartNumber: ABS07-32.768KHz-T; Packing: Tape and Reel; Frequency: 32.768 kHz
X3 = CMP-1688-00008-1: Ceramic SMD Crystal, 24 MHz, +/- 20 ppm, 50 Ohm, -20 to 70 degC, 4-Pin SMD, RoHS, Tape and Reel; Impedance: 50 Ohm; Mating Cycles: 30; Frequency: 6 Hz; Contact Material: Brass; Contact Plating: Gold; PackageReference: ABM3B; Min Operating Temperature: -40 degC; ComponentLink2Description: Datasheet; Radiation Hardening: No; DatasheetVersion: Aug-15; Packaging: Tape and Reel; Length: 2.6 mm; Package Quantity: 2500; REACH SVHC: Unknown; PackageDescription: 4-Pin Surface Mount Device, Body 5 x 3.2 mm; Weight: 0.001058 oz; ComponentLink2URL: http://www.abracon.com/Resonators/abm3b.pdf; ComponentLink1Description: Manufacturer URL; Width: 3 mm; RoHSCompliant: true; Fastening Type: Snap; Max Operating Temperature: 155 degC; ComponentLink1URL: http://www.abracon.com/; Height: 1.244 mm; Mount: Surface Mount

## Sheet uC.SchDoc
size Legal
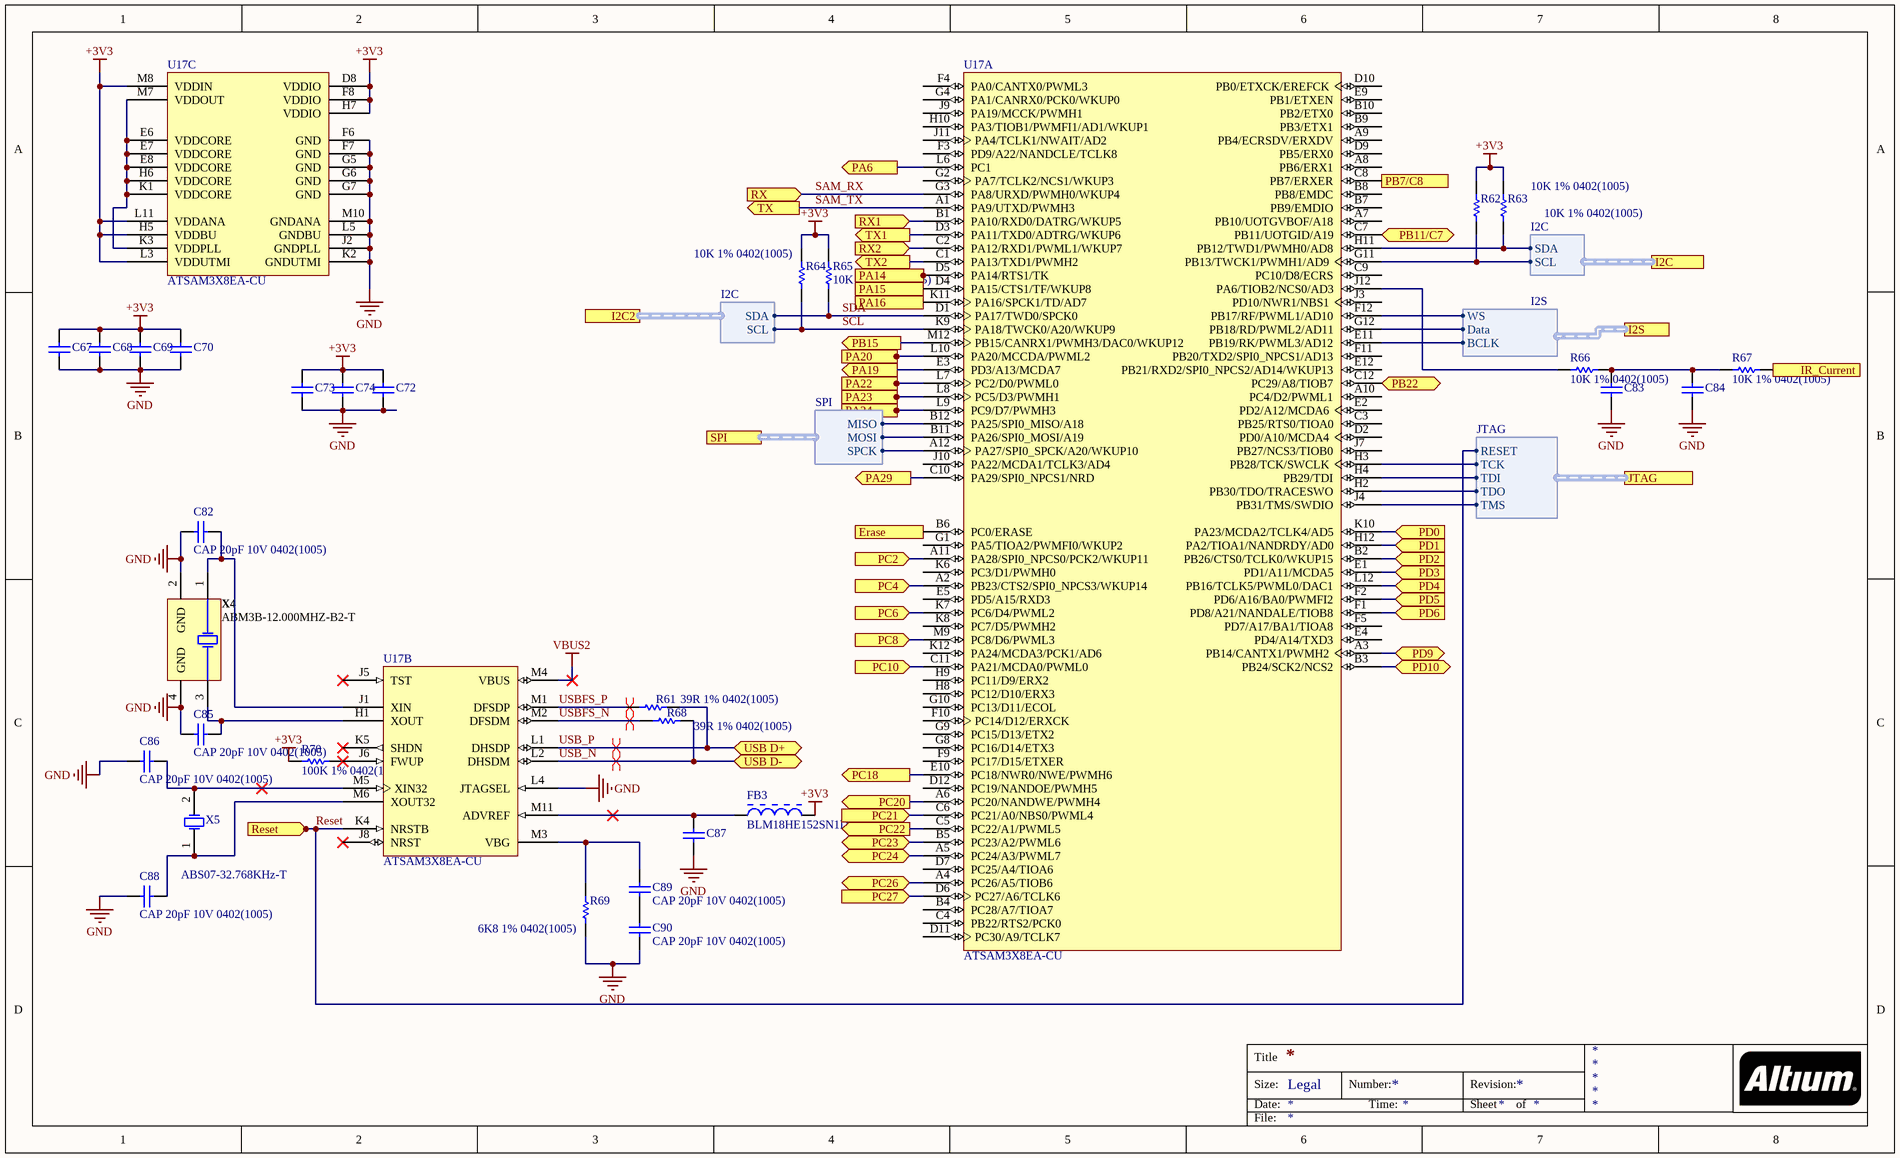
[diagram p8: uC.SchDoc]

### Parts
C67  CAP 100nF 10V 0402(1005)  [CAPC0402(1005)60_L]  (value not drawn)
C68  CAP 100nF 10V 0402(1005)  [CAPC0402(1005)60_L]  (value not drawn)
C69  CAP 100nF 10V 0402(1005)  [CAPC0402(1005)60_L]  (value not drawn)
C70  CAP 100nF 10V 0402(1005)  [CAPC0402(1005)60_L]  (value not drawn)
C72  CAP 100nF 10V 0402(1005)  [CAPC0402(1005)60_L]  (value not drawn)
C73  CAP 100nF 10V 0402(1005)  [CAPC0402(1005)60_L]  (value not drawn)
C74  CAP 100nF 10V 0402(1005)  [CAPC0402(1005)60_L]  (value not drawn)
C82  CAP 20pF 10V 0402(1005)  [CAPC0402(1005)60_L]
C83  CAP 100nF 10V 0402(1005)  [CAPC0402(1005)60_L]  (value not drawn)
C84  CAP 100nF 10V 0402(1005)  [CAPC0402(1005)60_L]  (value not drawn)
C85  CAP 20pF 10V 0402(1005)  [CAPC0402(1005)60_L]
C86  CAP 20pF 10V 0402(1005)  [CAPC0402(1005)60_L]
C87  CAP 100nF 10V 0402(1005)  [CAPC0402(1005)60_L]  (value not drawn)
C88  CAP 20pF 10V 0402(1005)  [CAPC0402(1005)60_L]
C89  CAP 20pF 10V 0402(1005)  [CAPC0402(1005)60_L]
C90  CAP 20pF 10V 0402(1005)  [CAPC0402(1005)60_L]
FB3  BLM18HE152SN1D  [MURA-BLM18-RF-H4-CHIP-2_V]
R61  39R 1% 0402(1005)  [RESC0402(1005)_L]
R62  10K 1% 0402(1005)  [RESC0402(1005)_L]
R63  10K 1% 0402(1005)  [RESC0402(1005)_L]
R64  10K 1% 0402(1005)  [RESC0402(1005)_L]
R65  10K 1% 0402(1005)  [RESC0402(1005)_L]
R66  10K 1% 0402(1005)  [RESC0402(1005)_L]
R67  10K 1% 0402(1005)  [RESC0402(1005)_L]
R68  39R 1% 0402(1005)  [RESC0402(1005)_L]
R69  6K8 1% 0402(1005)  [RESC0402(1005)_L]
R70  100K 1% 0402(1005)  [RESC0402(1005)_L]
U17  ATSAM3X8EA-CU  [LFBGA144]  (parts A,B,C of 3)
X4  ABM3B-12.000MHZ-B2-T  [ABRA-ABM3B-4_V]
X5  ABS07-32.768KHz-T  [ABRA-ABS07-2_V]

### Ports
Erase (in), I2C2 (harness I2C), I2C (harness I2C), I2S (harness I2S), IR_Current (out), JTAG (harness JTAG), PA6 (out), PA14 (out), PA15 (out), PA16 (in), PA19 (out), PA20 (in), PA22 (out), PA23 (out), PA24 (out), PA29 (out), PB7/C8 (in), PB11/C7 (bidir), PB15 (out), PB22 (bidir), PC2 (in), PC4 (in), PC6 (in), PC8 (in), PC10 (in), PC18 (out), PC20 (out), PC21 (in), PC22 (out), PC23 (bidir), PC24 (bidir), PC26 (bidir), PC27 (in), PD0 (in), PD1 (in), PD2 (in), PD3 (in), PD4 (in), PD5 (in), PD6 (in), PD9 (bidir), PD10 (bidir), Reset (in), RX1 (in), RX2 (in), RX (in), SPI (harness SPI), TX1 (out), TX2 (out), TX (out), USB D+ (bidir), USB D- (bidir)

### Harnesses
I2C: SCL, SDA
I2S: WS, BCLK, Data
SPI: MISO, MOSI, SPCK
JTAG: RESET, TCK, TDI, TDO, TMS

### Nets
+3V3: C67.2 C68.2 C69.2 C70.2 C72.2 C73.2 C74.2 FB3.2 R62.2 R63.2 R64.2 R65.2 R70.1 U17.D8(VDDIO) U17.F8(VDDIO) U17.H5(VDDBU) U17.H7(VDDIO) U17.L3(VDDUTMI) U17.L11(VDDANA) U17.M8(VDDIN)
GND: C67.1 C68.1 C69.1 C70.1 C72.1 C73.1 C74.1 C82.1 C83.1 C84.1 C85.1 C86.1 C87.1 C88.1 C90.2 R69.2 U17.F6(GND) U17.F7(GND) U17.G5(GND) U17.G6(GND) U17.G7(GND) U17.J2(GNDPLL) U17.K2(GNDUTMI) U17.L4(JTAGSEL) U17.L5(GNDBU) U17.M10(GNDANA) X4.2(GND) X4.4(GND)
VBUS2: U17.M4(VBUS)
CE: U17.L6(PC1) ; port PA6
MISO: U17.B12(PA25/SPI0_MISO/A18) ; port SPI.MISO
MOSI: U17.B11(PA26/SPI0_MOSI/A19) ; port SPI.MOSI
PROG2: U17.L8(PC5/D3/PWMH1) ; port PA23
Reset: U17.K4(NRSTB) ; port Reset, port JTAG.RESET
SAM_RX: U17.G3(PA8/URXD/PWMH0/WKUP4) ; port RX
SAM_TX: U17.A1(PA9/UTXD/PWMH3) ; port TX
SCL: R62.1 U17.G11(PB13/TWCK1/PWMH1/AD9) ; port I2C.SCL
SCL: R64.1 U17.K9(PA18/TWCK0/A20/WKUP9) ; port I2C2.SCL  [a separate net that carries the same name]
SDA: R63.1 U17.H11(PB12/TWD1/PWMH0/AD8) ; port I2C.SDA
SDA: R65.1 U17.D1(PA17/TWD0/SPCK0) ; port I2C2.SDA  [a separate net that carries the same name]
SEL: U17.L7(PC2/D0/PWML0) ; port PA22
SPCK: U17.A12(PA27/SPI0_SPCK/A20/WKUP10) ; port SPI.SPCK
~{TE}: U17.L9(PC9/D7/PWMH3) ; port PA24
TMS: U17.J4(PB31/TMS/SWDIO) ; port JTAG.TMS
USB_N: R68.2 U17.L2(DHSDM) ; port USB D-  [project net USB_1_N]
USB_P: R61.2 U17.L1(DHSDP) ; port USB D+  [project net USB_1_P]
USBFS_N: R68.1 U17.M2(DFSDM)
USBFS_P: R61.1 U17.M1(DFSDP)
NetC7_2: U17.B3(PB24/SCK2/NCS2) ; port PD10
NetC12_1: U17.L10(PA20/MCCDA/PWML2) ; port PA20
NetC56_1: U17.L12(PB16/TCLK5/PWML0/DAC1) ; port PD4
NetC60_1: U17.F2(PD6/A16/BA0/PWMFI2) ; port PD5
NetC64_1: U17.F1(PD8/A21/NANDALE/TIOB8) ; port PD6
NetC82_2: C82.2 U17.J1(XIN) X4.1(X1)
NetC83_2: C83.2 C84.2 R66.2 R67.1
NetC85_2: C85.2 U17.H1(XOUT) X4.3(X2)
NetC86_2: C86.2 U17.M5(XIN32) X5.2(X2)
NetC87_2: C87.2 FB3.1 U17.M11(ADVREF)
NetC88_2: C88.2 U17.M6(XOUT32) X5.1(X1)
NetC89_1: C89.1 R69.1 U17.M3(VBG)
NetC89_2: C89.2 C90.1
NetC115_2: U17.C12(PC29/A8/TIOB7) ; port PB22
NetCC1_41: U17.D3(PA11/TXD0/ADTRG/WKUP6) ; port TX1
NetCC1_42: U17.B1(PA10/RXD0/DATRG/WKUP5) ; port RX1
NetJ1_2: U17.C2(PA12/RXD1/PWML1/WKUP7) ; port RX2
NetJ1_3: U17.C1(PA13/TXD1/PWMH2) ; port TX2
NetJ1_5: U17.D5(PA14/RTS1/TK) ; port PA14
NetJ1_9: U17.D4(PA15/CTS1/TF/WKUP8) ; port PA15
NetJ4_2: U17.E3(PD3/A13/MCDA7) ; port PA19
NetJ7_8: U17.K11(PA16/SPCK1/TD/AD7) ; port PA16
NetP2_4: U17.H3(PB28/TCK/SWCLK) ; port JTAG.TCK
NetP2_6: U17.H2(PB30/TDO/TRACESWO) ; port JTAG.TDO
NetP2_8: U17.H4(PB29/TDI) ; port JTAG.TDI
NetQ1_3: U17.B6(PC0/ERASE) ; port Erase
NetQ8_1: U17.E10(PC18/NWR0/NWE/PWMH6) ; port PC18
NetR51_1: U17.E1(PD1/A11/MCDA5) ; port PD3
NetR66_1: R66.1 U17.J12(PA6/TIOB2/NCS0/AD3)
NetR67_2: R67.2 ; port IR_Current
NetR70_2: R70.2 U17.J6(FWUP)
NetR77_2: U17.F12(PB17/RF/PWML1/AD10) ; port I2S.WS
NetR78_2: U17.G12(PB18/RD/PWML2/AD11) ; port I2S.Data
NetR79_2: U17.E11(PB19/RK/PWML3/AD12) ; port I2S.BCLK
NetR95_1: U17.C10(PA29/SPI0_NPCS1/NRD) ; port PA29
NetU12_4: U17.B2(PB26/CTS0/TCLK0/WKUP15) ; port PD2
NetU15_12: U17.K10(PA23/MCDA2/TCLK4/AD5) ; port PD0
NetU17_A2: U17.A2(PB23/CTS2/SPI0_NPCS3/WKUP14) ; port PC4
NetU17_A3: U17.A3(PB14/CANTX1/PWMH2) ; port PD9
NetU17_A4: U17.A4(PC26/A5/TIOB6) ; port PC26
NetU17_A5: U17.A5(PC24/A3/PWML7) ; port PC24
NetU17_A6: U17.A6(PC20/NANDWE/PWMH4) ; port PC20
NetU17_A11: U17.A11(PA28/SPI0_NPCS0/PCK2/WKUP11) ; port PC2
NetU17_B5: U17.B5(PC23/A2/PWML6) ; port PC23
NetU17_C5: U17.C5(PC22/A1/PWML5) ; port PC22
NetU17_C6: U17.C6(PC21/A0/NBS0/PWML4) ; port PC21
NetU17_C7: U17.C7(PB11/UOTGID/A19) ; port PB11/C7
NetU17_C8: U17.C8(PB7/ERXER) ; port PB7/C8
NetU17_C11: U17.C11(PA21/MCDA0/PWML0) ; port PC10
NetU17_D6: U17.D6(PC27/A6/TCLK6) ; port PC27
NetU17_E6: U17.E6(VDDCORE) U17.E7(VDDCORE) U17.E8(VDDCORE) U17.H6(VDDCORE) U17.K1(VDDCORE) U17.K3(VDDPLL) U17.M7(VDDOUT)
NetU17_H12: U17.H12(PA2/TIOA1/NANDRDY/AD0) ; port PD1
NetU17_K7: U17.K7(PC6/D4/PWML2) ; port PC6
NetU17_M9: U17.M9(PC8/D6/PWML3) ; port PC8
NetU17_M12: U17.M12(PB15/CANRX1/PWMH3/DAC0/WKUP12) ; port PB15

Not connected (* = marked no-connect by the designer): U17 A7(PB10/UOTGVBOF/A18) A8(PB6/ERX1) A9(PB4/ECRSDV/ERXDV) A10(PC4/D2/PWML1) B4(PC28/A7/TIOA7) B7(PB9/EMDIO) B8(PB8/EMDC) B9(PB3/ETX1) B10(PB2/ETX0) C3(PB25/RTS0/TIOA0) C4(PB22/RTS2/PCK0) C9(PC10/D8/ECRS) D2(PD0/A10/MCDA4) D7(PC25/A4/TIOA6) D9(PB5/ERX0) D10(PB0/ETXCK/EREFCK) D11(PC30/A9/TCLK7) D12(PC19/NANDOE/PWMH5) E2(PD2/A12/MCDA6) E4(PD4/A14/TXD3) E5(PD5/A15/RXD3) E9(PB1/ETXEN) E12(PB21/RXD2/SPI0_NPCS2/AD14/WKUP13) F3(PD9/A22/NANDCLE/TCLK8) F4(PA0/CANTX0/PWML3) F5(PD7/A17/BA1/TIOA8) F9(PC17/D15/ETXER) F10(PC14/D12/ERXCK) F11(PB20/TXD2/SPI0_NPCS1/AD13) G1(PA5/TIOA2/PWMFI0/WKUP2) G2(PA7/TCLK2/NCS1/WKUP3) G4(PA1/CANRX0/PCK0/WKUP0) G8(PC16/D14/ETX3) G9(PC15/D13/ETX2) G10(PC13/D11/ECOL) H8(PC12/D10/ERX3) H9(PC11/D9/ERX2) H10(PA3/TIOB1/PWMFI1/AD1/WKUP1) J3(PD10/NWR1/NBS1) J5(TST)* J7(PB27/NCS3/TIOB0) J8(NRST)* J9(PA19/MCCK/PWMH1) J10(PA22/MCDA1/TCLK3/AD4) J11(PA4/TCLK1/NWAIT/AD2) K5(SHDN)* K6(PC3/D1/PWMH0) K8(PC7/D5/PWMH2) K12(PA24/MCDA3/PCK1/AD6)

### Layout directives
differential pair: USB_1_N, USB_1_P, USBFS_N, USBFS_P

### Notes on the sheet
- Title
- Size:
- Date:
- Legal
- Number:
- Time:
- Revision:
- Sheet
- of
- File:

### Library data of the parts
C67-C70 C72-C74 C83 C84 C87 = CMP-1034-02066-1: CAP 100nF 10V ±20% 0402 (1005 Metric) Thickness 0.6mm SMD; Tolerance: Â±20%; Case-Metric: 1005; Case-EIA: 0402; Max Thickness: 0.6 mm; Rated Voltage: 10 V; Technology: SMT; Value: 100nF
C82 C85 C86 C88-C90 = CMP-1034-00874-1: CAP 20pF 10V ±5% 0402 (1005 Metric) Thickness 0.6mm SMD; Case-EIA: 0402; Tolerance: Â±5%; Case-Metric: 1005; Value: 20pF; Rated Voltage: 10 V; Technology: SMT; Max Thickness: 0.6 mm
FB3 = CMP-0686-00368-2: Chip Ferrite Bead for GHz Band High-speed Signal Lines, 1500 Ohm, 500 mA, -55 to 125 degC, 1.6 x 0.8 x 0.95 mm SMD, Tape and Reel; Manufacturer: Murata; Rated Current: 500 mA; Impedance (at 100 MHz): 1500 Ohm +/- 25%; DC Resistance: 0.50 Ohm Max.; Packing: Tape and Reel; DatasheetVersion: 08/2013; ComponentLink1URL: http://www.murata.com/; Mounting Technology: Surface Mount; ComponentLink2URL: http://www.murata.com/products/catalog/pdf/c31e.pdf; ComponentLink3Description: Package Specification; ComponentLink2Description: Datasheet; PackageReference: BLM18_H950-2; ComponentLink1Description: Manufacturer URL; PackageDescription: 2-Pin Chip, Body 1.6 x 0.8 mm; ComponentLink3URL: http://www.murata.com/products/catalog/pdf/c31e.pdf; PartNumber: BLM18HE152SN1D; Operating Temperature Range: -55 to 125 degC
R61 R68 = CMP-1011-00350-1: 39R 0.063W 1% 0402 (1005 Metric)  SMD; Case-EIA: 0402; Value: 39.00 Ohm; Case-Metric: 1005; Tolerance: 1 %; Power: 0.063 W; Technology: SMT
R62-R67 = CMP-1011-00623-1: 10K 0.063W 1% 0402 (1005 Metric)  SMD; Case-EIA: 0402; Value: 10000.00 Ohm; Case-Metric: 1005; Technology: SMT; Tolerance: 1 %; Power: 0.063 W
R69 = CMP-1011-00604-1: 6K8 0.063W 1% 0402 (1005 Metric)  SMD; Value: 6800.00 Ohm; Case-Metric: 1005; Case-EIA: 0402; Technology: SMT; Tolerance: 1 %; Power: 0.063 W
R70 = CMP-1011-00736-1: 100K 0.063W 1% 0402 (1005 Metric)  SMD; Value: 100000.00 Ohm; Case-Metric: 1005; Case-EIA: 0402; Power: 0.063 W; Tolerance: 1 %; Technology: SMT
U17 = CMP-0076-00181-1: SAM3X ARM Cortex-M3 Flash-based Microcontroller, 512 KB Flash, 96 KB SRAM, 103 User I/Os, 1.62 to 3.6 V, -40 to 85 degC, 144-Pin LFBGA, RoHS; Manufacturer: Atmel; Max. Operating Freq.: 84 MHz; ADC Channels: 16; Max I/O Pins: 103; CAN: 2; # of Touch Channels: 32; ADC Resolution: 12 bits; SPI: 4; Flash: 512 Kbytes; UART: 5; SRAM: 96 Kbytes; ComponentLink1URL: http://www.atmel.com/; Mounting Technology: Surface Mount; ComponentLink3URL: http://www.atmel.com/Images/doc11057.pdf; Operating Voltage: 1.62 to 3.6 V; ComponentLink1Description: Manufacturer URL; PackageReference: LFBGA-144; ComponentLink2URL: http://www.atmel.com/Images/doc11057.pdf; Temp. Range: -40 to 85 degC; RoHS: TRUE; ComponentLink2Description: Datasheet; DAC Channels: 2; PackageDescription: 144-Ball Ball Grid Array, Body 10 x 10 mm, Pitch 0.8 mm; PackageVersion: 11057B; PartNumber: ATSAM3X8EA-CU; ComponentLink3Description: Package Specification; DatasheetVersion: 11057B; PartId: 2
X4 = CMP-1688-00007-1: Ceramic SMD Crystal, 12 MHz, +/- 20 ppm, 70 Ohm, -20 to 70 degC, 4-Pin SMD, RoHS, Tape and Reel; Case\Package: TO-263-4; Outputs: 1; Max Input Voltage: 25 V; Dropout Voltage: 2 V; Max Ouput Current: 1.5 A; Nominal Output Voltage: 5 V; Min Input Voltage: 7 V; Mount: Surface Mount; ComponentLink2Description: Datasheet; DatasheetVersion: Aug-15; PackageReference: ABM3B; Radiation Hardening: No; Weight: 0.050897 oz; ComponentLink1URL: http://www.abracon.com/; RoHSCompliant: true; Max Operating Temperature: 125 degC; PackageDescription: 4-Pin Surface Mount Device, Body 5 x 3.2 mm; ComponentLink1Description: Manufacturer URL; Package Quantity: 500; Output Voltage: 5 V; ComponentLink2URL: http://www.abracon.com/Resonators/abm3b.pdf; Min Operating Temperature: 0 degC; Output Current: 1.5 A; Packaging: Tape and Reel; Pins: 3; REACH SVHC: No SVHC
X5 = CMP-0447-00001-2: Crystal, 32.768 kHz, 12.5 pF, -40 to 85 degC, SMD Low Profile 3.2 x 1.5 x 0.9 mm, Tape and Reel; Manufacturer: Abracon; Q Value (Type): 30000; Operation Mode: Flexural Mode (Tuning Fork); Shunt Capacitance (C0): 0.9 to 1.2 pF; Load Capacitance (CL): 12.5 pF; Frequency Tolerance @+25degC: +/- 20 ppm; Drive Level (Type): 0.1 uW; Equivalent Series Resistance (R1): 70 Kohm; Insulation Resistance (Min): 500 Mohm; ComponentLink3URL: http://www.abracon.com/Resonators/ABS07.pdf; PackageDescription: 2-Pin Hand Drawn, Body 3.2x1.5mm, Pitch 2.5mm; Operating Temperature: -40 to 85 degC; ComponentLink2URL: http://www.abracon.com/Resonators/ABS07.pdf; PackageReference: ABS07-2; ComponentLink3Description: Package Specification; ComponentLink1Description: Manufacturer URL; DatasheetVersion: 04.03.13; Mounting Technology: Surface Mount; ComponentLink2Description: Datasheet; ComponentLink1URL: http://www.abracon.com/; PartNumber: ABS07-32.768KHz-T; Packing: Tape and Reel; Frequency: 32.768 kHz

## Sheet Sensors.SchDoc
size Letter
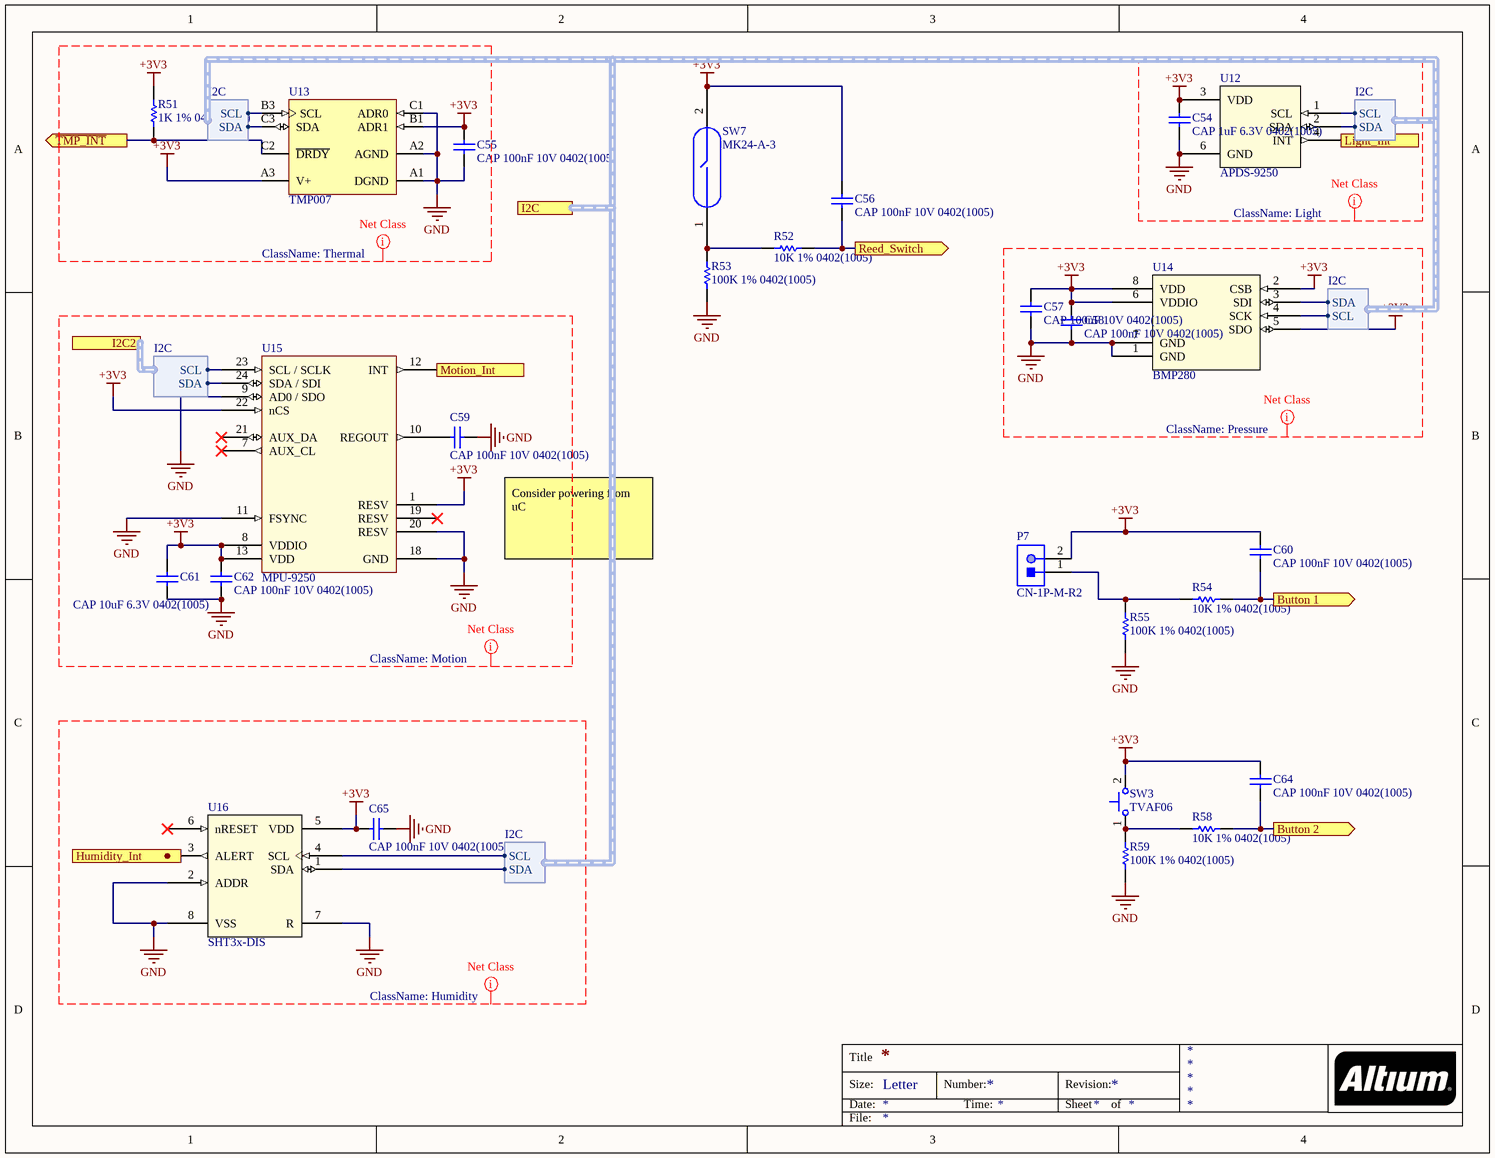
[diagram p9: Sensors.SchDoc]

### Parts
C54  CAP 1uF 6.3V 0402(1005)  [CAPC0402(1005)60_L]
C55  CAP 100nF 10V 0402(1005)  [CAPC0402(1005)60_L]
C56  CAP 100nF 10V 0402(1005)  [CAPC0402(1005)60_L]
C57  CAP 100nF 10V 0402(1005)  [CAPC0402(1005)60_L]
C58  CAP 100nF 10V 0402(1005)  [CAPC0402(1005)60_L]
C59  CAP 100nF 10V 0402(1005)  [CAPC0402(1005)60_L]
C60  CAP 100nF 10V 0402(1005)  [CAPC0402(1005)60_L]
C61  CAP 10uF 6.3V 0402(1005)  [CAPC0402(1005)60_L]
C62  CAP 100nF 10V 0402(1005)  [CAPC0402(1005)60_L]
C64  CAP 100nF 10V 0402(1005)  [CAPC0402(1005)60_L]
C65  CAP 100nF 10V 0402(1005)  [CAPC0402(1005)60_L]
P7  CN-1P-M-R2  [B2B-PH-K-S]
R51  1K 1% 0402(1005)  [RESC0402(1005)_L]
R52  10K 1% 0402(1005)  [RESC0402(1005)_L]
R53  100K 1% 0402(1005)  [RESC0402(1005)_L]
R54  10K 1% 0402(1005)  [RESC0402(1005)_L]
R55  100K 1% 0402(1005)  [RESC0402(1005)_L]
R58  10K 1% 0402(1005)  [RESC0402(1005)_L]
R59  100K 1% 0402(1005)  [RESC0402(1005)_L]
SW3  TVAF06  [JNFU-TVAF06_V]
SW7  MK24-A-3  [MK24]
U12  APDS-9250  [SON65P200X75-6N]
U13  TMP007  [YZF0008AHAH]
U14  BMP280  [LGA4C65P2X4_200X250X95]
U15  MPU-9250  [QFN40P300X300X105_HS-25N]
U16  SHT3x-DIS  [SHT3x-DIS]

### Ports
Button 1 (out), Button 2 (out), Humidity_Int (out), I2C2 (harness I2C), I2C (harness I2C), Light_Int (out), Motion_Int (out), Reed_Switch (out), ~{TMP_INT} (out)

### Harnesses
I2C: SDA, SCL
I2C: SCL, SDA

### Nets
+3V3: C54.2 C55.2 C56.2 C57.2 C58.2 C60.2 C61.2 C62.2 C64.2 C65.1 P7.2 R51.2 SW3.2 SW7.2 U12.3(VDD) U13.A3(V+) U13.B1(ADR1) U14.2(CSB) U14.5(SDO) U14.6(VDDIO) U14.8(VDD) U15.1(RESV) U15.8(VDDIO) U15.13(VDD) U15.22(nCS) U16.5(VDD)
GND: C54.1 C55.1 C57.1 C58.1 C59.2 C61.1 C62.1 C65.2 R53.2 R55.2 R59.2 U12.6(GND) U13.A1(DGND) U13.A2(AGND) U13.C1(ADR0) U14.1(GND) U14.7(GND) U15.9(AD0_/_SDO) U15.11(FSYNC) U15.18(GND) U15.20(RESV) U16.2(ADDR) U16.7(R) U16.8(VSS)
SCL: U12.1(SCL) U13.B3(SCL) U14.4(SCK) U16.4(SCL) ; port I2C.SCL
SCL: U15.23(SCL_/_SCLK) ; port I2C2.SCL  [a separate net that carries the same name]
SDA: U12.2(SDA) U13.C3(SDA) U14.3(SDI) U16.1(SDA) ; port I2C.SDA
SDA: U15.24(SDA_/_SDI) ; port I2C2.SDA  [a separate net that carries the same name]
NetC56_1: C56.1 R52.2 ; port Reed_Switch
NetC59_1: C59.1 U15.10(REGOUT)
NetC60_1: C60.1 R54.2 ; port Button 1
NetC64_1: C64.1 R58.2 ; port Button 2
NetP7_1: P7.1 R54.1 R55.1
NetR51_1: R51.1 U13.C2(~{DRDY}) ; port ~{TMP_INT}
NetR52_1: R52.1 R53.1 SW7.1
NetR58_1: R58.1 R59.1 SW3.1
NetU12_4: U12.4(INT) ; port Light_Int
NetU15_12: U15.12(INT) ; port Motion_Int

Not connected (* = marked no-connect by the designer): U15 7(AUX_CL)* 19(RESV)* 21(AUX_DA)*; U16 3(ALERT) 6(nRESET)*

### Layout directives
net class Motion: +3V3, GND
net class Thermal: +3V3, GND
net class Humidity: +3V3, GND
net class Pressure: +3V3, GND
net class Light: +3V3, GND

### Notes on the sheet
- Consider powering from uC
- Title
- Size:
- Date:
- Letter
- Number:
- Time:
- Revision:
- Sheet
- of
- File:

### Library data of the parts
C54 = CMP-1034-02115-1: CAP 1uF 6.3V -20% to +80% 0402 (1005 Metric) Thickness 0.6mm SMD; Case-Metric: 1005; Case-EIA: 0402; Value: 1uF; Tolerance: -20% to +80%; Rated Voltage: 6.3 V; Max Thickness: 0.6 mm; Technology: SMT
C55-C60 C62 C64 C65 = CMP-1034-02066-1: as C67-C70 on sheet uC; Max Thickness: 0.6 mm; Rated Voltage: 10 V; Technology: SMT; Value: 100nF
C61 = CMP-1034-02138-1: CAP 10uF 6.3V ±20% 0402 (1005 Metric) Thickness 0.6mm SMD; Case-Metric: 1005; Case-EIA: 0402; Tolerance: Â±20%; Rated Voltage: 6.3 V; Technology: SMT; Max Thickness: 0.6 mm; Value: 10uF
R51 = CMP-1011-00510-1: 1K 0.063W 1% 0402 (1005 Metric)  SMD; Case-Metric: 1005; Case-EIA: 0402; Value: 1000.00 Ohm; Technology: SMT; Tolerance: 1 %; Power: 0.063 W
R52 R54 R58 = CMP-1011-00623-1: as R62-R67 on sheet uC; Technology: SMT; Tolerance: 1 %; Power: 0.063 W
R53 R55 R59 = CMP-1011-00736-1: as R70 on sheet uC; Power: 0.063 W; Tolerance: 1 %; Technology: SMT
SW3 = CMP-0587-00001-2: Switch, SPST Push Button, 50 mA, 12 V DC, SMD, -30 to 85 degC, RoHS; Manufacturer: Jianfu; Contact Resistance: 100 mW max; Lifetime: 100000 Cycles min; Rating: 50 mA. 12 V DC; Insulation Resistance: 100 MW min. 100 V DC; Travel: 0.13 +/- 0.05 mm; Dielectric Strength: 250 V AC for 1 min; RoHS: TRUE; Mounting Technology: Surface Mount; PartNumber: TVAF06; PackageDescription: 2-Pin Switch, Push Button, SMD, Body 2.9 x 3.9 mm; ComponentLink1Description: Manufacturer URL; ComponentLink1URL: http://www.jian-fu.com/; Operating Temperature: -30 to 85 degC; ComponentLink2URL: http://en.jian-fu.com/product-22.html; PackageReference: TVAF06; ComponentLink2Description: Datasheet
SW7 = MK24
U12 = APDS-9250: Digital RGB, IR and Ambient Light Sensor
U13 = CMP-0978-00001-2: Infrared Thermopile Sensor, 2.2 to 3.6 V, 240 uA, -40 to 125 degC, 8-Pin BGA (YZF8), Green (RoHS & no Sb/Br), Tape and Reel; Manufacturer: Texas Instruments; Temp Resolution (Max): 14 Bit; Supply Current (Typ): 240 uA; Two-Wire Interface Voltage: 3.3 V; ComponentLink3URL: http://www.ti.com/lit/ml/mxbg053j/mxbg053j.pdf; ComponentLink2URL: http://www.ti.com/lit/ds/sbos518c/sbos518c.pdf; RoHS: TRUE; Packing: Tape and Reel; Supply Voltage: 2.2 to 3.6 V; Temperature Range: -40 to 125 degC; DatasheetVersion: SBOS518C; PartNumber: TMP007; Mounting Technology: Surface Mount; PackageReference: YZF0008AHAH; PackageVersion: 4205058-3/P; ComponentLink1URL: http://www.ti.com/; ComponentLink1Description: Manufacturer URL; ComponentLink2Description: Datasheet; PackageDescription: 8-Pin Ball Grid Array, Body 1.5345 x 1.5345 mm, Pitch 0.5 mm; ComponentLink3Description: Package Specification
U14 = BMP280: Digital Pressure Sensor
U15 = MPU-9250: MPU-9250 Nine-Axis (Gyro + Accelerometer + Compass) MEMS MotionTracking™ Device
U16 = SHT3x: Humidity and Temperature Sensor

## Sheet Audio.SchDoc
size A
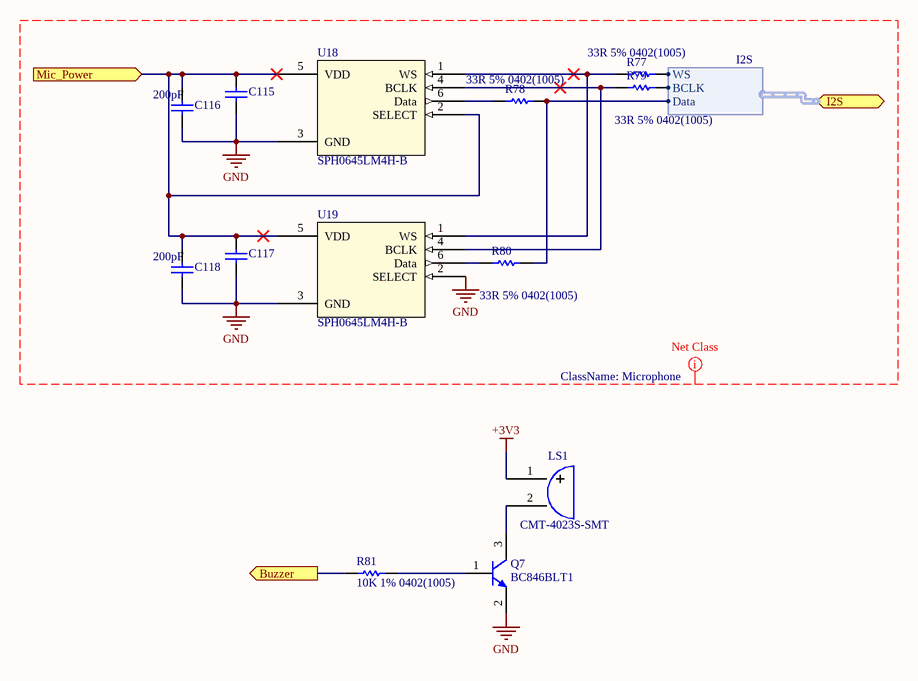
[diagram p10: Audio.SchDoc]

### Parts
C115  CAP 100nF 10V 0402(1005)  [CAPC0402(1005)60_L]  (value not drawn)
C116  value 200pF  [CAPC0402(1005)60_L]  (hidden comment: CAP 200pF 10V 0402(1005))
C117  CAP 100nF 10V 0402(1005)  [CAPC0402(1005)60_L]  (value not drawn)
C118  value 200pF  [CAPC0402(1005)60_L]  (hidden comment: CAP 200pF 10V 0402(1005))
LS1  CMT-4023S-SMT  [CMT-4023S-SMT]
Q7  BC846BLT1  [ONSC-SOT-23-3-318-08_V]
R77  33R 5% 0402(1005)  [RESC0402(1005)_M]
R78  33R 5% 0402(1005)  [RESC0402(1005)_M]
R79  33R 5% 0402(1005)  [RESC0402(1005)_M]
R80  33R 5% 0402(1005)  [RESC0402(1005)_M]
R81  10K 1% 0402(1005)  [RESC0402(1005)_L]
U18  SPH0645LM4H-B  [SPH0645LM4H-B]
U19  SPH0645LM4H-B  [SPH0645LM4H-B]

### Ports
Buzzer (out), I2S (harness I2S), Mic_Power (in)

### Harnesses
I2S: WS, BCLK, Data

### Nets
+3V3: LS1.1(+)
GND: C115.1 C116.1 C117.1 C118.1 Q7.2(E) U18.3(GND) U19.2(SELECT) U19.3(GND)
NetC115_2: C115.2 C116.2 C117.2 C118.2 U18.2(SELECT) U18.5(VDD) U19.5(VDD) ; port Mic_Power
NetLS1_2: LS1.2(-) Q7.3(C)
NetQ7_1: Q7.1(B) R81.2
NetR77_1: R77.1 U18.1(WS) U19.1(WS)
NetR77_2: R77.2 ; port I2S.WS
NetR78_1: R78.1 U18.6(Data)
NetR78_2: R78.2 R80.2 ; port I2S.Data
NetR79_1: R79.1 U18.4(BCLK) U19.4(BCLK)
NetR79_2: R79.2 ; port I2S.BCLK
NetR80_1: R80.1 U19.6(Data)
NetR81_1: R81.1 ; port Buzzer

### Layout directives
net class Microphone: GND

### Library data of the parts
C115 C117 = CMP-1034-02066-1: as C67-C70 on sheet uC; Max Thickness: 0.6 mm; Rated Voltage: 10 V; Technology: SMT; Value: 100nF
C116 C118 = CMP-1034-01342-1: CAP 200pF 10V ±1% 0402 (1005 Metric) Thickness 0.6mm SMD; Case-EIA: 0402; Tolerance: Â±1%; Case-Metric: 1005; Technology: SMT; Rated Voltage: 10 V; Max Thickness: 0.6 mm
LS1 = CMT-4023S-SMT: Buzzer
Q7 = CMP-1048-00761-1: General Purpose Transistor, NPN Silicon, 3-Pin SOT-23, Tape and Reel; Manufacturer: On Semiconductor; IC Continuous (A): 0.1; fT Min (MHz): 100; RoHS: FALSE; Mounting Technology: Surface Mount; ComponentLink3Description: Package Specification; DatasheetVersion: Rev. 11; Polarity: NPN; PackageDescription: 3-Pin Small Outline Transistor, Body 2.92 x 1.3 mm, Pitch 0.95 mm; ComponentLink3URL: http://www.onsemi.cn/pub_link/Collateral/318-08.PDF; ComponentLink1Description: Manufacturer URL; ComponentLink2Description: Datasheet; PackageVersion: Rev. AP, 11/2009; ComponentLink2URL: http://www.onsemi.cn/pub_link/Collateral/BC846ALT1-D.PDF; Packing: Tape and Reel; PartNumber: BC846BLT1; ComponentLink1URL: http://www.onsemi.com/; PackageReference: SOT-23-3-318-08
R77-R80 = CMP-1011-00038-1: 33R 0.063W 5% 0402 (1005 Metric)  SMD; Case-EIA: 0402; Case-Metric: 1005; Value: 33.00 Ohm; Technology: SMT; Tolerance: 5 %; Power: 0.063 W
R81 = CMP-1011-00623-1: as R62-R67 on sheet uC; Technology: SMT; Tolerance: 1 %; Power: 0.063 W